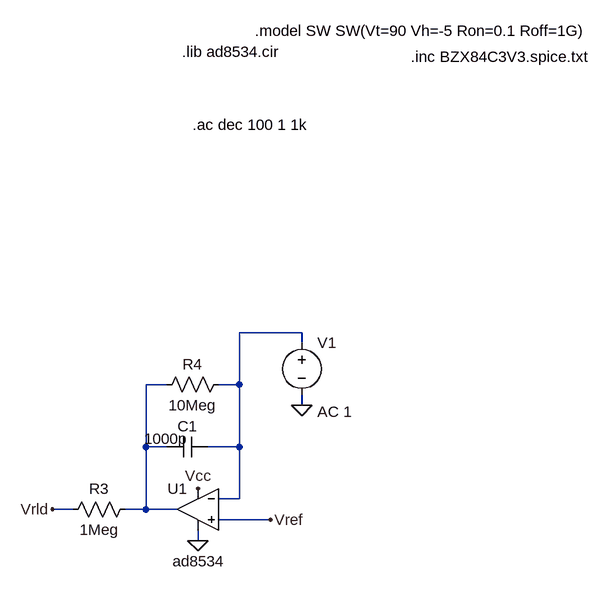
[diagram p0: schematic RLDseparat.asc]
RLDseparat.asc, the LTspice schematic file:
Version 4.1
SHEET 1 880 944
WIRE 144 576 48 576
WIRE 144 592 144 576
WIRE -64 656 -96 656
WIRE 48 656 48 576
WIRE 48 656 16 656
WIRE 144 688 144 672
WIRE -96 752 -96 656
WIRE -64 752 -96 752
WIRE 48 752 48 656
WIRE 48 752 0 752
WIRE 48 832 48 752
WIRE 48 832 16 832
WIRE -208 848 -240 848
WIRE -96 848 -96 752
WIRE -96 848 -128 848
WIRE -48 848 -96 848
WIRE 96 864 16 864
WIRE -16 896 -16 880
FLAG 96 864 Vref
FLAG -240 848 Vrld
FLAG -16 816 Vcc
FLAG -16 896 0
FLAG 144 688 0
SYMBOL OpAmps\\opamp2 -16 784 M0
WINDOW 3 -42 144 Left 2
SYMATTR Value ad8534
SYMATTR InstName U1
SYMBOL cap 0 736 R90
WINDOW 0 0 32 VBottom 2
WINDOW 3 -12 65 VTop 2
SYMATTR InstName C1
SYMATTR Value 1000p
SYMBOL res -112 832 R90
WINDOW 0 0 56 VBottom 2
WINDOW 3 32 56 VTop 2
SYMATTR InstName R3
SYMATTR Value 1Meg
SYMBOL res 32 640 R90
WINDOW 0 0 56 VBottom 2
WINDOW 3 32 56 VTop 2
SYMATTR InstName R4
SYMATTR Value 10Meg
SYMBOL voltage 144 576 R0
WINDOW 123 24 122 Left 2
WINDOW 39 0 0 Left 0
SYMATTR InstName V1
SYMATTR Value ""
SYMATTR Value2 AC 1
TEXT -40 144 Left 2 !.lib ad8534.cir
TEXT 72 112 Left 2 !.model SW SW(Vt=90 Vh=-5 Ron=0.1 Roff=1G)
TEXT 312 152 Left 2 !.inc BZX84C3V3.spice.txt
TEXT -24 256 Left 2 !.ac dec 100 1 1k

The netlist it stands for:
* RLDseparat.asc
X§U1 Vref N001 Vcc 0 N002 ad8534  ; pins In+ In- V+ V- OUT
C1 N001 N002 1000p
R3 N002 Vrld 1Meg
R4 N001 N002 10Meg
V1 N001 0 AC 1
.lib ad8534.cir
.model SW SW(Vt=90 Vh=-5 Ron=0.1 Roff=1G)
.inc BZX84C3V3.spice.txt
.ac dec 100 1 1k
.backanno
.end